# EAGLE schematic hanover-7320-20-01 (EAGLE 9.6.1), part 4 of 4
## Sheet 7 of 7: Dots R17-32 C17-32
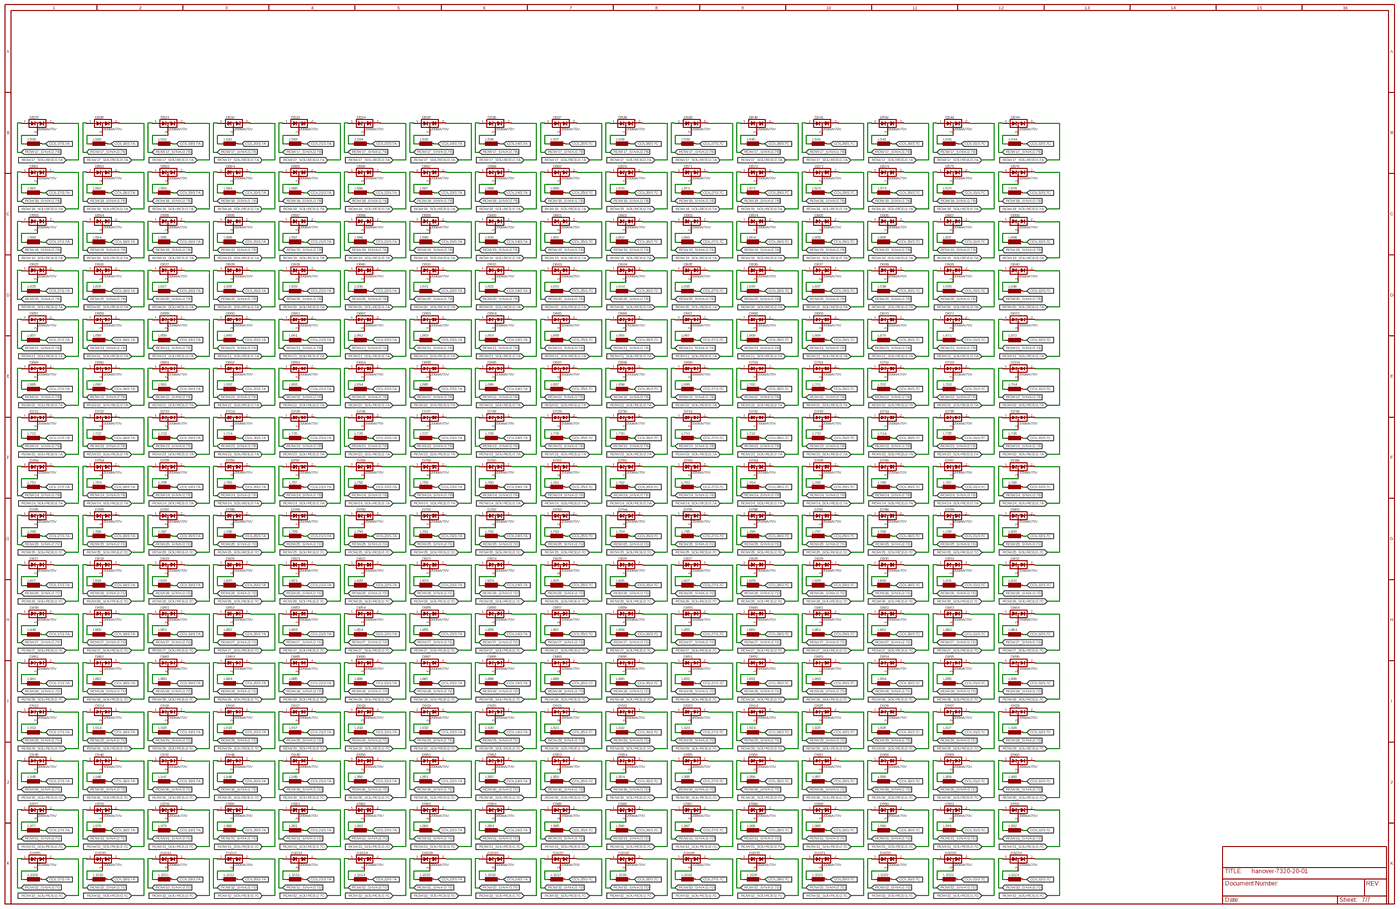
[diagram p14: schematic, sheet 7, overview]
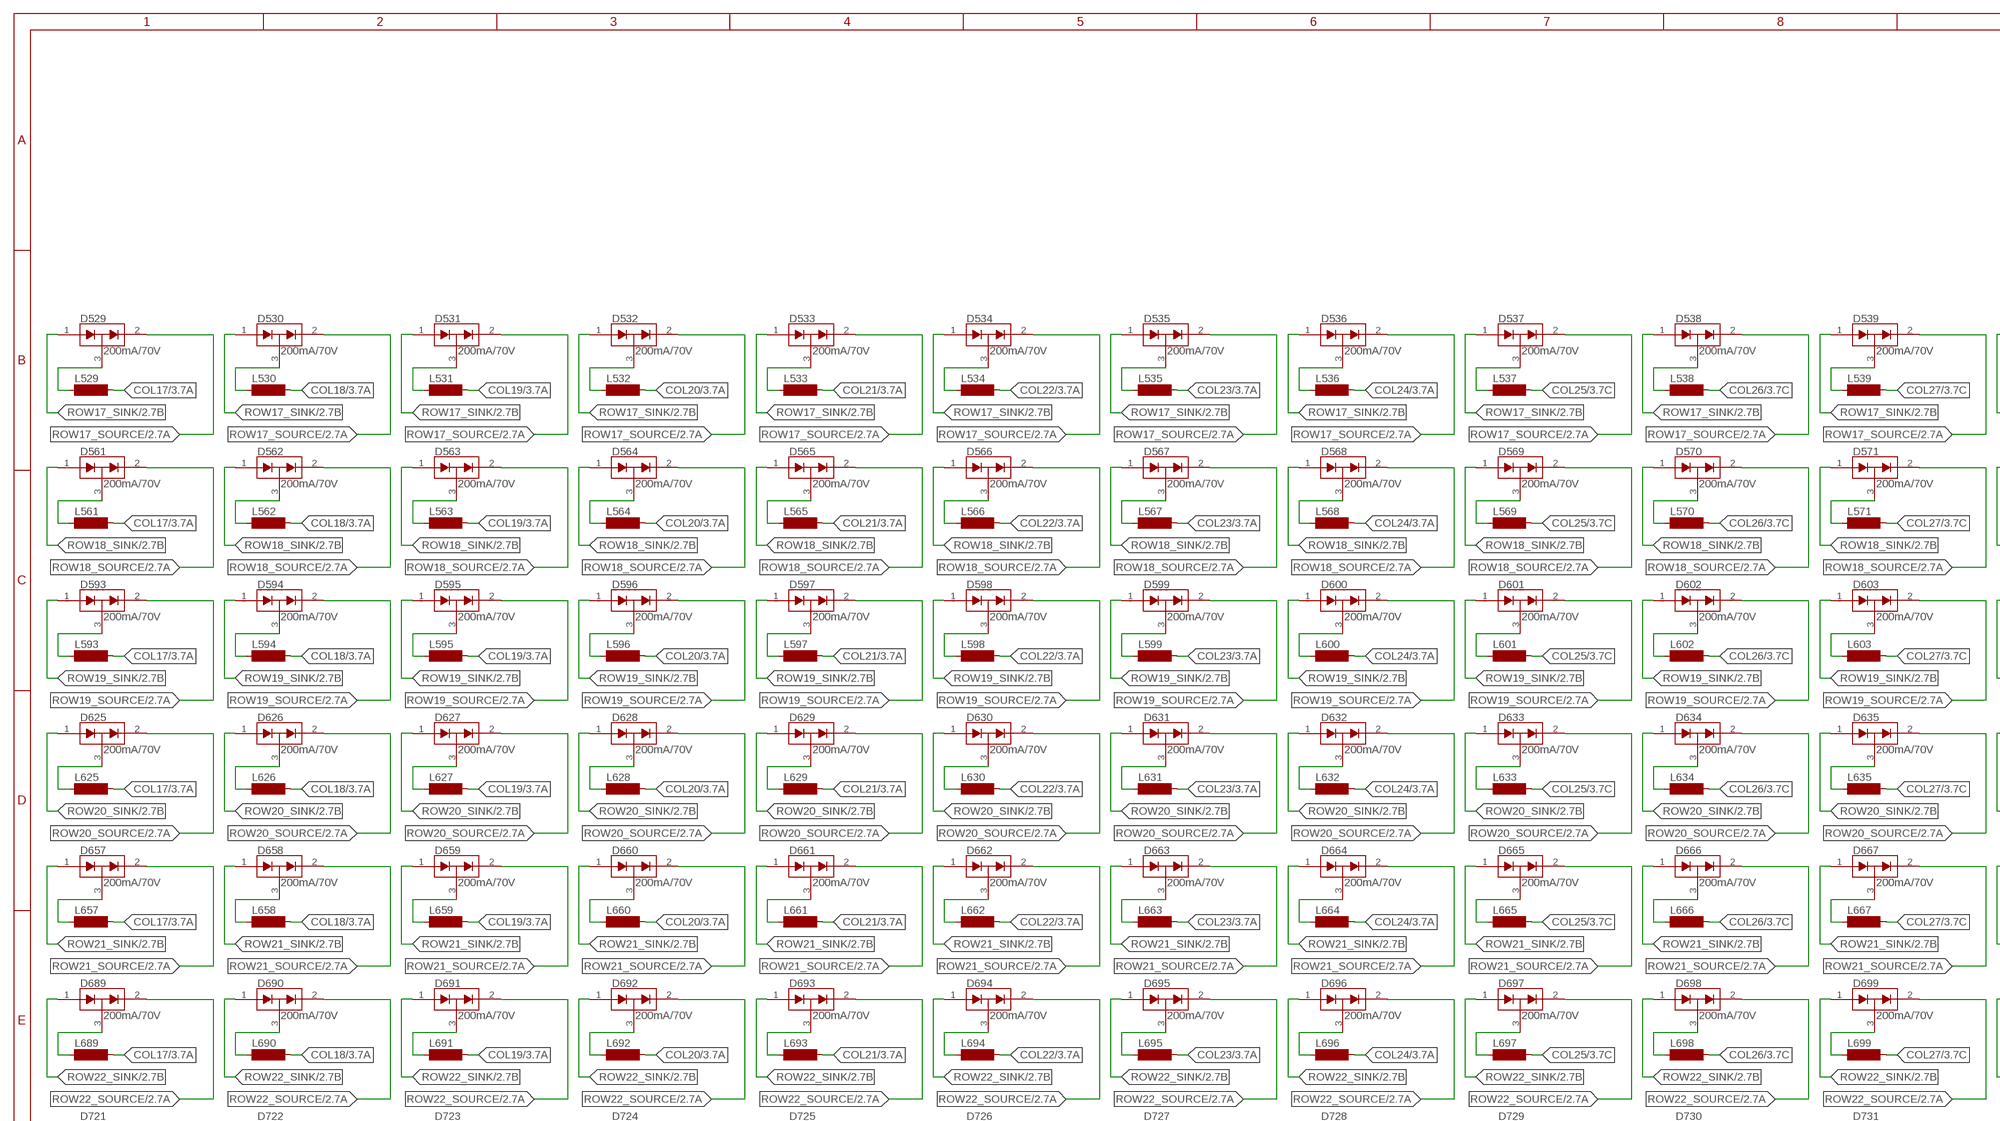
[diagram p15: schematic, sheet 7, part 1 of 4]
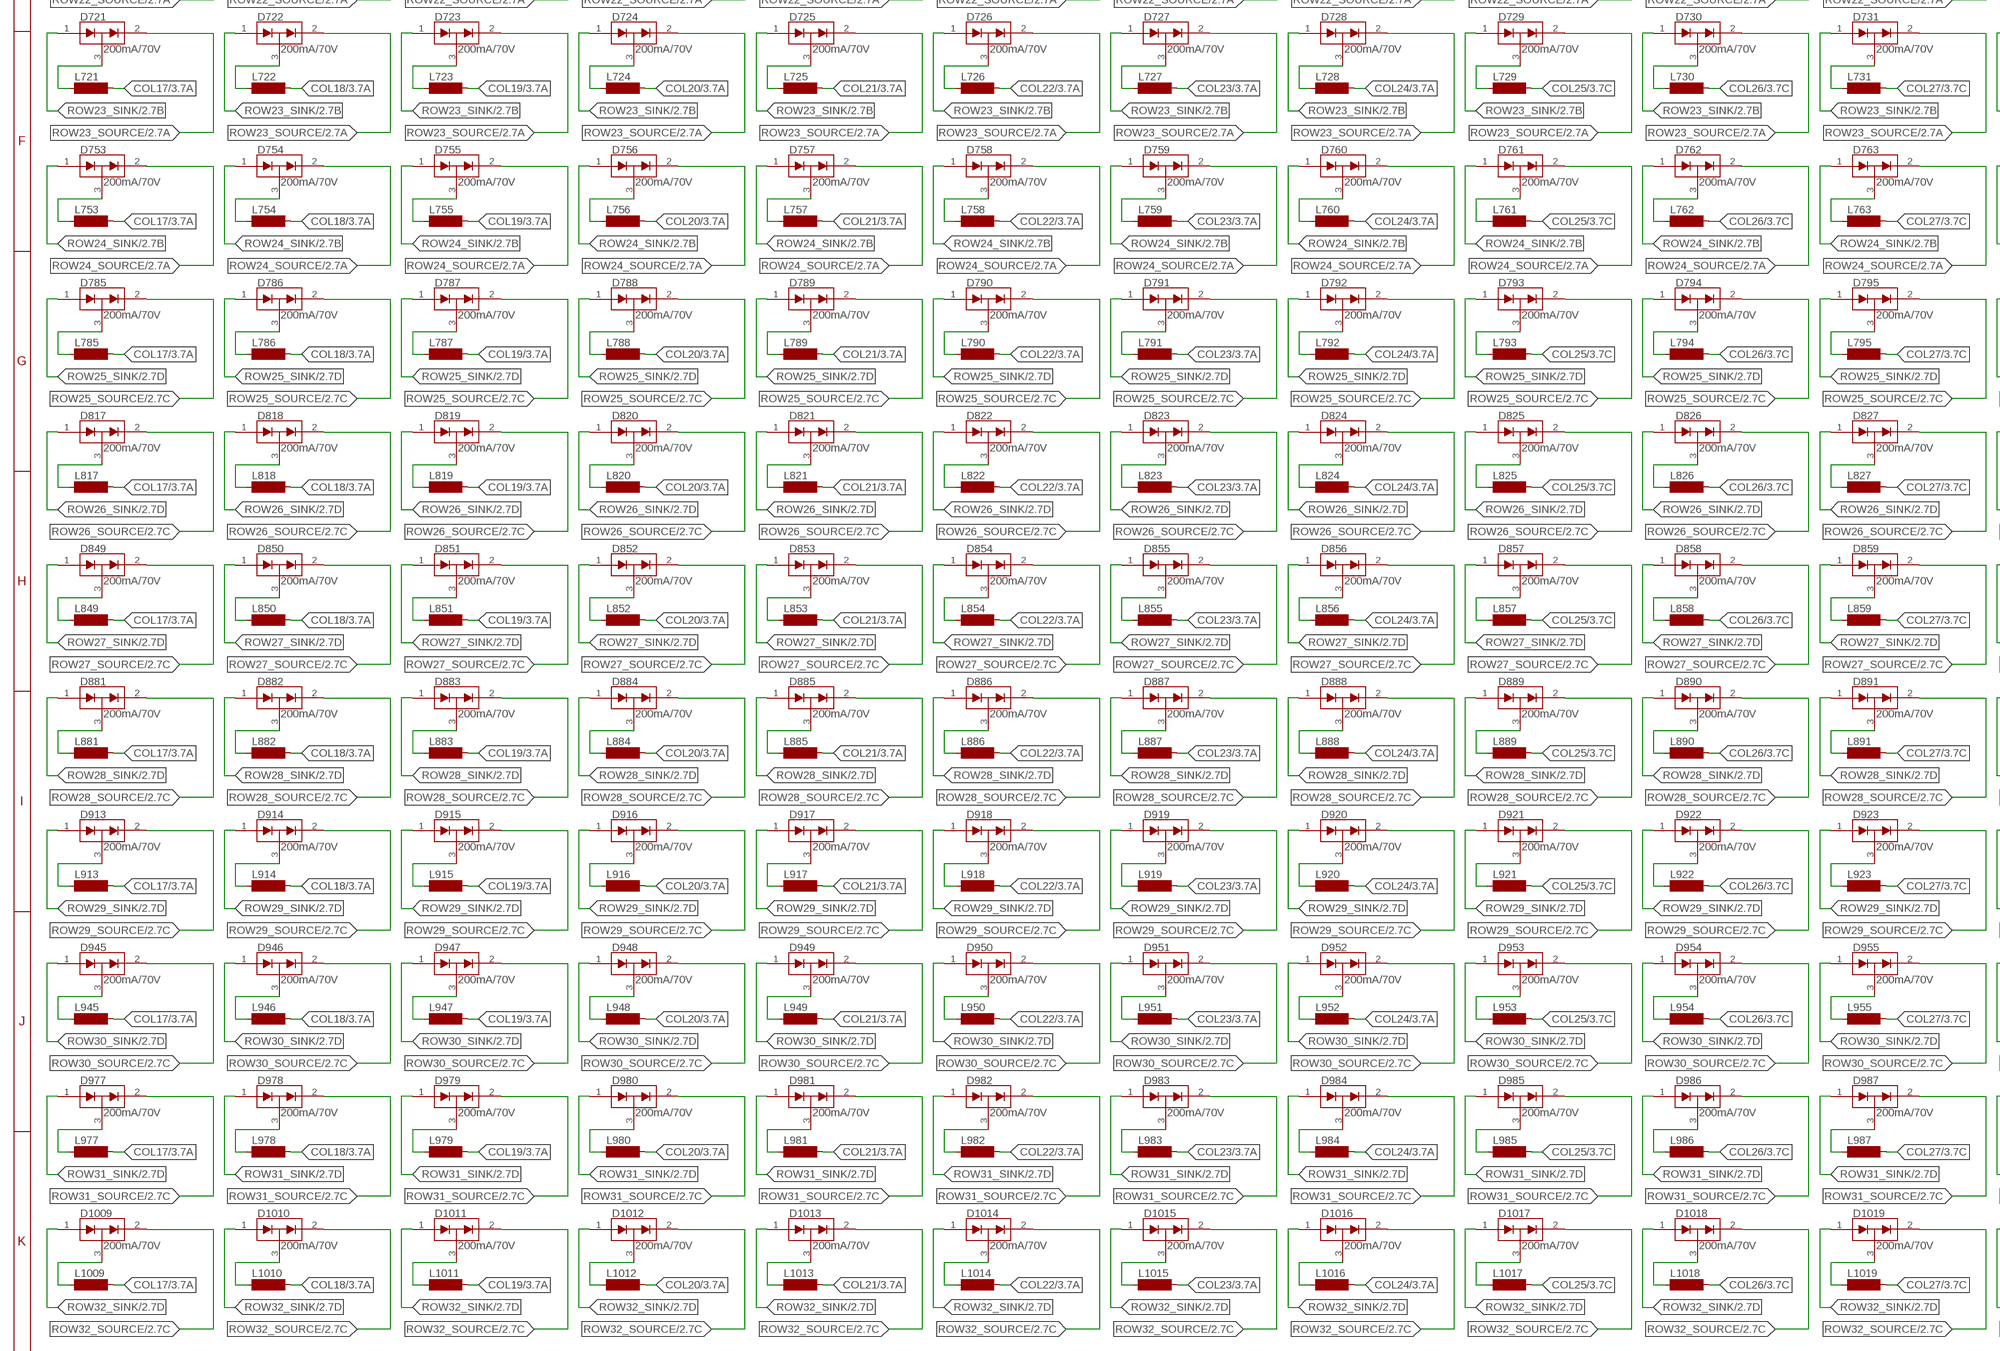
[diagram p16: schematic, sheet 7, part 2 of 4]
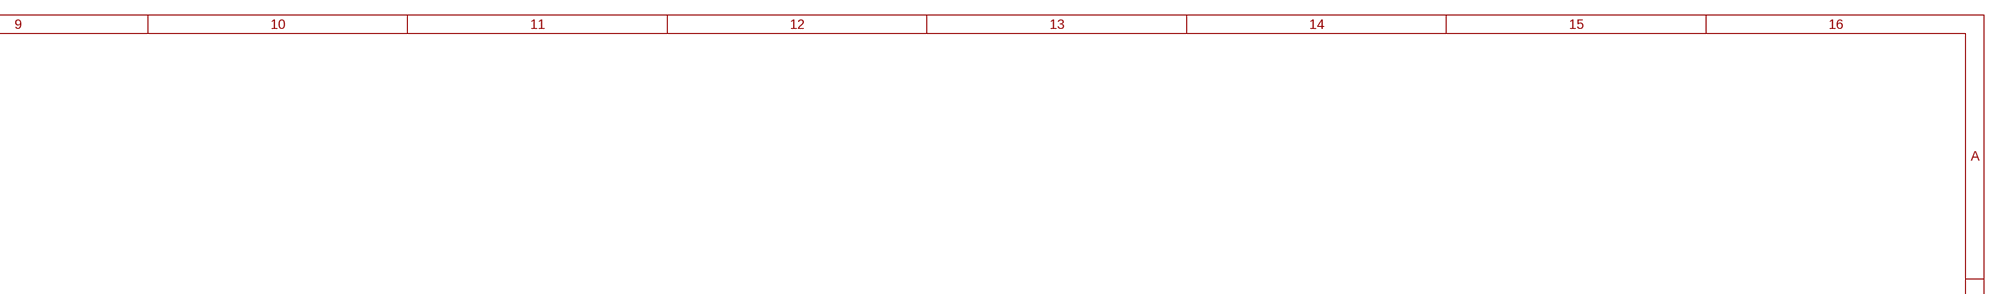
[diagram p17: schematic, sheet 7, part 3 of 4]
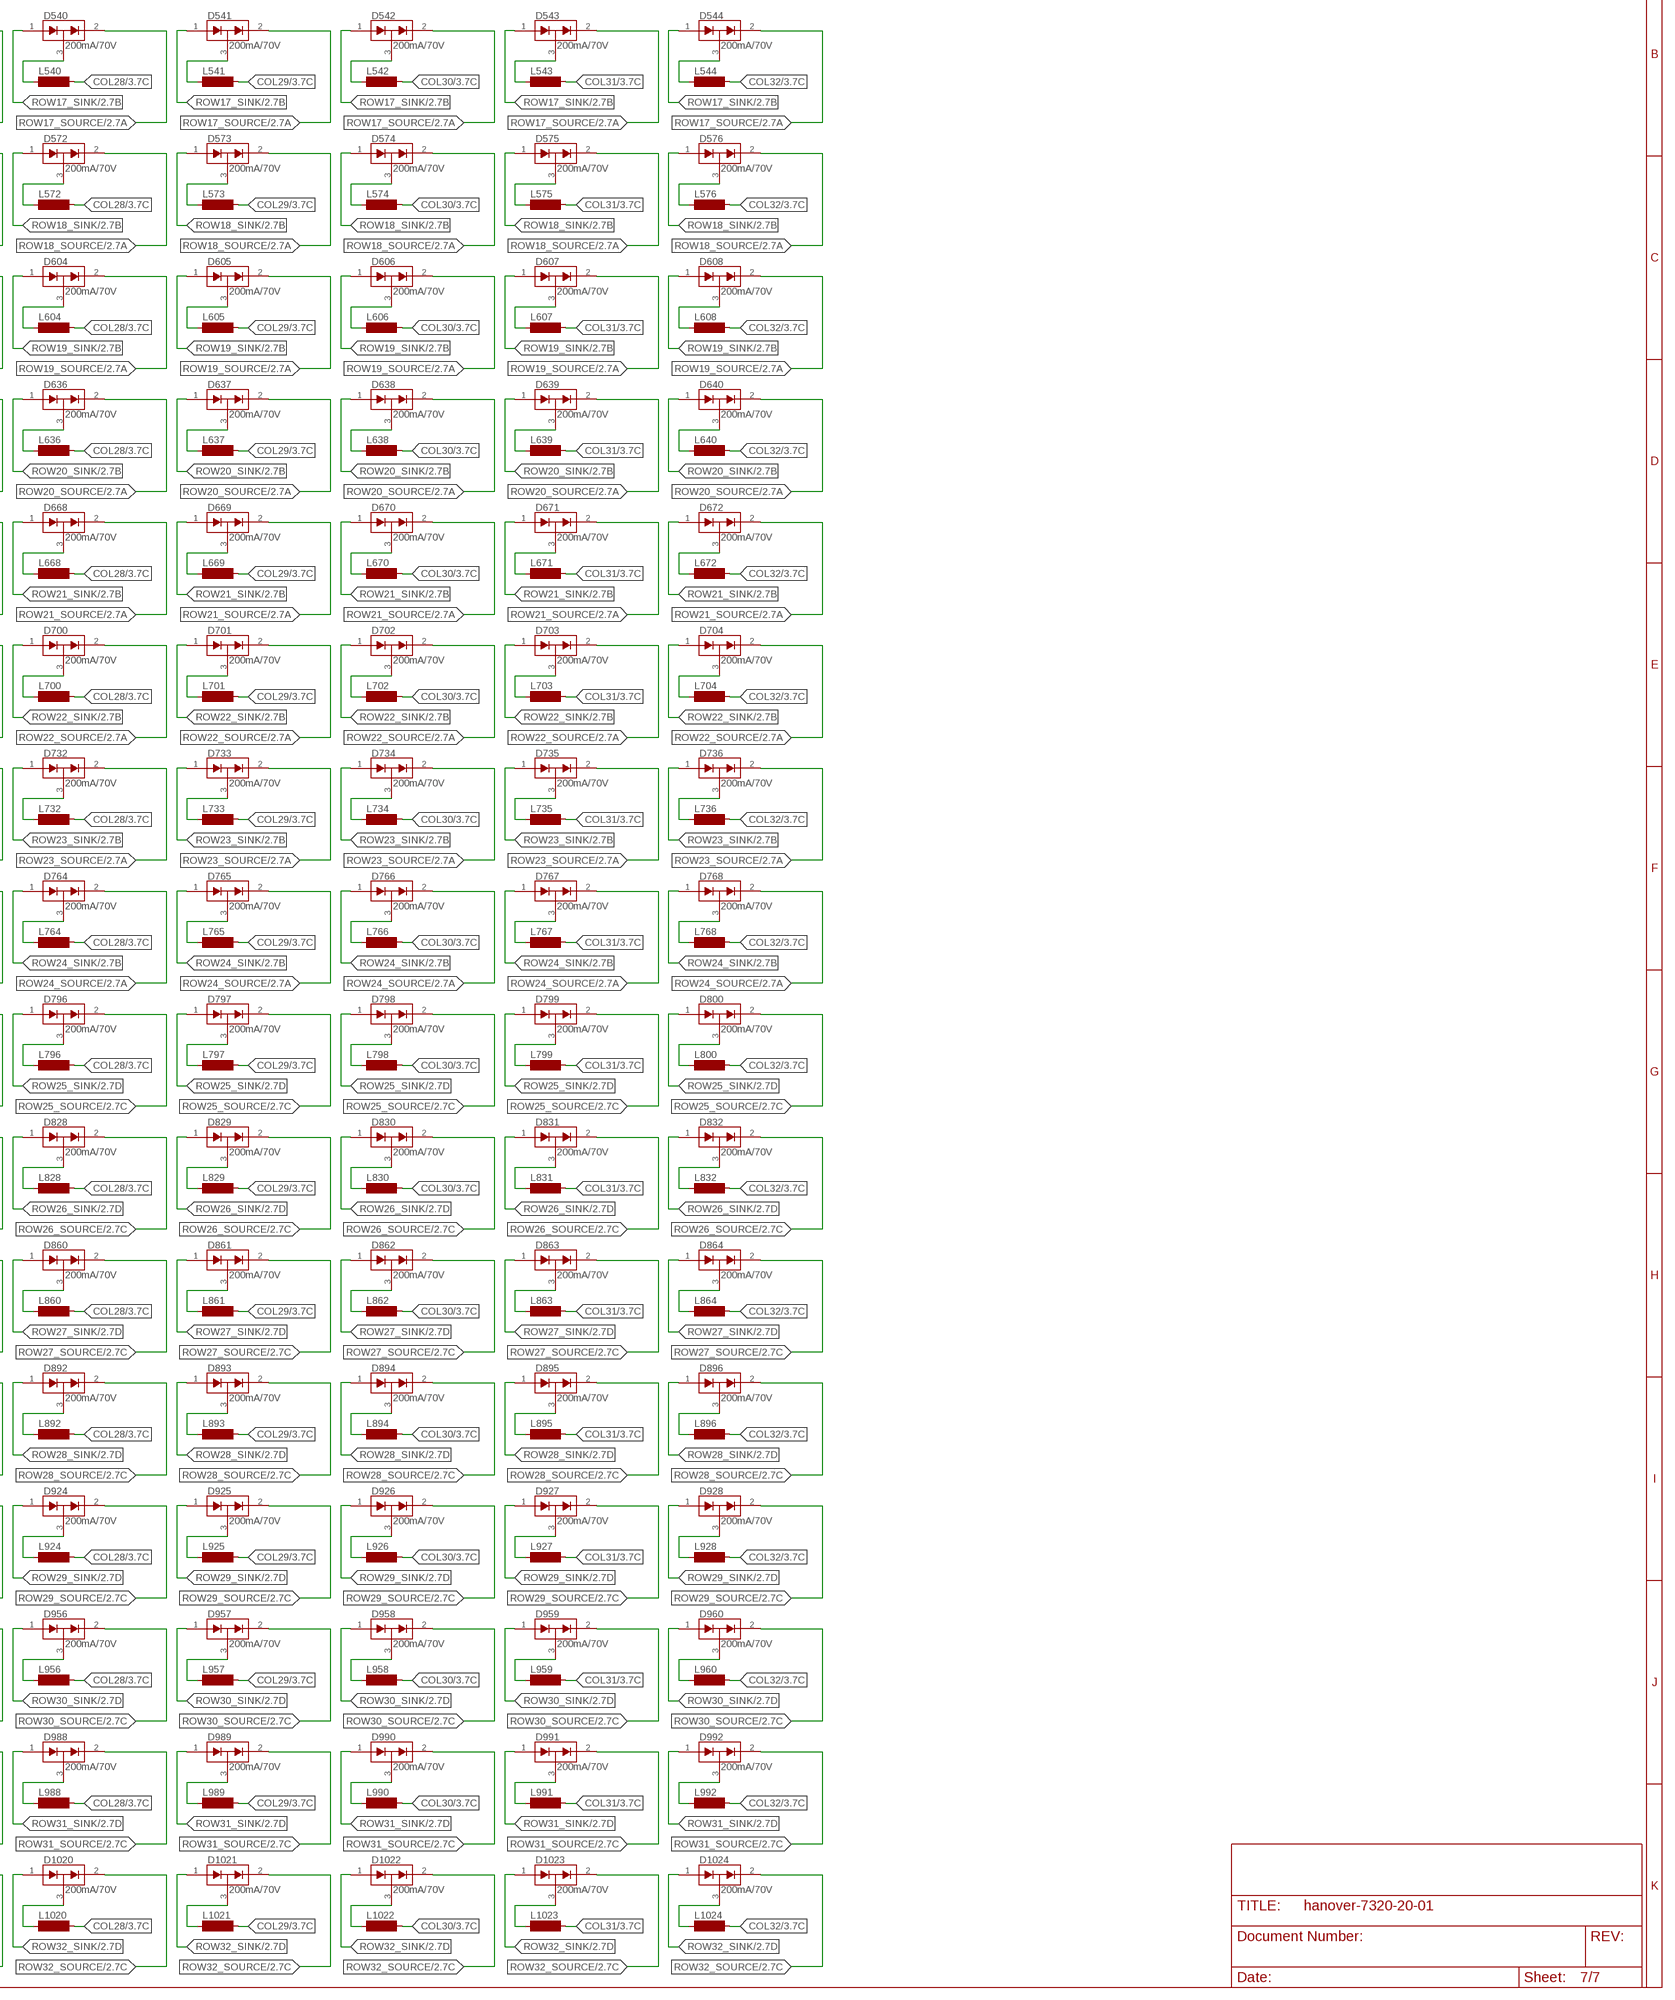
[diagram p18: schematic, sheet 7, part 4 of 4]

### Parts
D529  200mA/70V  BAV99  [SOT23-3]
D530  200mA/70V  BAV99  [SOT23-3]
D531  200mA/70V  BAV99  [SOT23-3]
D532  200mA/70V  BAV99  [SOT23-3]
D533  200mA/70V  BAV99  [SOT23-3]
D534  200mA/70V  BAV99  [SOT23-3]
D535  200mA/70V  BAV99  [SOT23-3]
D536  200mA/70V  BAV99  [SOT23-3]
D537  200mA/70V  BAV99  [SOT23-3]
D538  200mA/70V  BAV99  [SOT23-3]
D539  200mA/70V  BAV99  [SOT23-3]
D540  200mA/70V  BAV99  [SOT23-3]
D541  200mA/70V  BAV99  [SOT23-3]
D542  200mA/70V  BAV99  [SOT23-3]
D543  200mA/70V  BAV99  [SOT23-3]
D544  200mA/70V  BAV99  [SOT23-3]
D561  200mA/70V  BAV99  [SOT23-3]
D562  200mA/70V  BAV99  [SOT23-3]
D563  200mA/70V  BAV99  [SOT23-3]
D564  200mA/70V  BAV99  [SOT23-3]
D565  200mA/70V  BAV99  [SOT23-3]
D566  200mA/70V  BAV99  [SOT23-3]
D567  200mA/70V  BAV99  [SOT23-3]
D568  200mA/70V  BAV99  [SOT23-3]
D569  200mA/70V  BAV99  [SOT23-3]
D570  200mA/70V  BAV99  [SOT23-3]
D571  200mA/70V  BAV99  [SOT23-3]
D572  200mA/70V  BAV99  [SOT23-3]
D573  200mA/70V  BAV99  [SOT23-3]
D574  200mA/70V  BAV99  [SOT23-3]
D575  200mA/70V  BAV99  [SOT23-3]
D576  200mA/70V  BAV99  [SOT23-3]
D593  200mA/70V  BAV99  [SOT23-3]
D594  200mA/70V  BAV99  [SOT23-3]
D595  200mA/70V  BAV99  [SOT23-3]
D596  200mA/70V  BAV99  [SOT23-3]
D597  200mA/70V  BAV99  [SOT23-3]
D598  200mA/70V  BAV99  [SOT23-3]
D599  200mA/70V  BAV99  [SOT23-3]
D600  200mA/70V  BAV99  [SOT23-3]
D601  200mA/70V  BAV99  [SOT23-3]
D602  200mA/70V  BAV99  [SOT23-3]
D603  200mA/70V  BAV99  [SOT23-3]
D604  200mA/70V  BAV99  [SOT23-3]
D605  200mA/70V  BAV99  [SOT23-3]
D606  200mA/70V  BAV99  [SOT23-3]
D607  200mA/70V  BAV99  [SOT23-3]
D608  200mA/70V  BAV99  [SOT23-3]
D625  200mA/70V  BAV99  [SOT23-3]
D626  200mA/70V  BAV99  [SOT23-3]
D627  200mA/70V  BAV99  [SOT23-3]
D628  200mA/70V  BAV99  [SOT23-3]
D629  200mA/70V  BAV99  [SOT23-3]
D630  200mA/70V  BAV99  [SOT23-3]
D631  200mA/70V  BAV99  [SOT23-3]
D632  200mA/70V  BAV99  [SOT23-3]
D633  200mA/70V  BAV99  [SOT23-3]
D634  200mA/70V  BAV99  [SOT23-3]
D635  200mA/70V  BAV99  [SOT23-3]
D636  200mA/70V  BAV99  [SOT23-3]
D637  200mA/70V  BAV99  [SOT23-3]
D638  200mA/70V  BAV99  [SOT23-3]
D639  200mA/70V  BAV99  [SOT23-3]
D640  200mA/70V  BAV99  [SOT23-3]
D657  200mA/70V  BAV99  [SOT23-3]
D658  200mA/70V  BAV99  [SOT23-3]
D659  200mA/70V  BAV99  [SOT23-3]
D660  200mA/70V  BAV99  [SOT23-3]
D661  200mA/70V  BAV99  [SOT23-3]
D662  200mA/70V  BAV99  [SOT23-3]
D663  200mA/70V  BAV99  [SOT23-3]
D664  200mA/70V  BAV99  [SOT23-3]
D665  200mA/70V  BAV99  [SOT23-3]
D666  200mA/70V  BAV99  [SOT23-3]
D667  200mA/70V  BAV99  [SOT23-3]
D668  200mA/70V  BAV99  [SOT23-3]
D669  200mA/70V  BAV99  [SOT23-3]
D670  200mA/70V  BAV99  [SOT23-3]
D671  200mA/70V  BAV99  [SOT23-3]
D672  200mA/70V  BAV99  [SOT23-3]
D689  200mA/70V  BAV99  [SOT23-3]
D690  200mA/70V  BAV99  [SOT23-3]
D691  200mA/70V  BAV99  [SOT23-3]
D692  200mA/70V  BAV99  [SOT23-3]
D693  200mA/70V  BAV99  [SOT23-3]
D694  200mA/70V  BAV99  [SOT23-3]
D695  200mA/70V  BAV99  [SOT23-3]
D696  200mA/70V  BAV99  [SOT23-3]
D697  200mA/70V  BAV99  [SOT23-3]
D698  200mA/70V  BAV99  [SOT23-3]
D699  200mA/70V  BAV99  [SOT23-3]
D700  200mA/70V  BAV99  [SOT23-3]
D701  200mA/70V  BAV99  [SOT23-3]
D702  200mA/70V  BAV99  [SOT23-3]
D703  200mA/70V  BAV99  [SOT23-3]
D704  200mA/70V  BAV99  [SOT23-3]
D721  200mA/70V  BAV99  [SOT23-3]
D722  200mA/70V  BAV99  [SOT23-3]
D723  200mA/70V  BAV99  [SOT23-3]
D724  200mA/70V  BAV99  [SOT23-3]
D725  200mA/70V  BAV99  [SOT23-3]
D726  200mA/70V  BAV99  [SOT23-3]
D727  200mA/70V  BAV99  [SOT23-3]
D728  200mA/70V  BAV99  [SOT23-3]
D729  200mA/70V  BAV99  [SOT23-3]
D730  200mA/70V  BAV99  [SOT23-3]
D731  200mA/70V  BAV99  [SOT23-3]
D732  200mA/70V  BAV99  [SOT23-3]
D733  200mA/70V  BAV99  [SOT23-3]
D734  200mA/70V  BAV99  [SOT23-3]
D735  200mA/70V  BAV99  [SOT23-3]
D736  200mA/70V  BAV99  [SOT23-3]
D753  200mA/70V  BAV99  [SOT23-3]
D754  200mA/70V  BAV99  [SOT23-3]
D755  200mA/70V  BAV99  [SOT23-3]
D756  200mA/70V  BAV99  [SOT23-3]
D757  200mA/70V  BAV99  [SOT23-3]
D758  200mA/70V  BAV99  [SOT23-3]
D759  200mA/70V  BAV99  [SOT23-3]
D760  200mA/70V  BAV99  [SOT23-3]
D761  200mA/70V  BAV99  [SOT23-3]
D762  200mA/70V  BAV99  [SOT23-3]
D763  200mA/70V  BAV99  [SOT23-3]
D764  200mA/70V  BAV99  [SOT23-3]
D765  200mA/70V  BAV99  [SOT23-3]
D766  200mA/70V  BAV99  [SOT23-3]
D767  200mA/70V  BAV99  [SOT23-3]
D768  200mA/70V  BAV99  [SOT23-3]
D785  200mA/70V  BAV99  [SOT23-3]
D786  200mA/70V  BAV99  [SOT23-3]
D787  200mA/70V  BAV99  [SOT23-3]
D788  200mA/70V  BAV99  [SOT23-3]
D789  200mA/70V  BAV99  [SOT23-3]
D790  200mA/70V  BAV99  [SOT23-3]
D791  200mA/70V  BAV99  [SOT23-3]
D792  200mA/70V  BAV99  [SOT23-3]
D793  200mA/70V  BAV99  [SOT23-3]
D794  200mA/70V  BAV99  [SOT23-3]
D795  200mA/70V  BAV99  [SOT23-3]
D796  200mA/70V  BAV99  [SOT23-3]
D797  200mA/70V  BAV99  [SOT23-3]
D798  200mA/70V  BAV99  [SOT23-3]
D799  200mA/70V  BAV99  [SOT23-3]
D800  200mA/70V  BAV99  [SOT23-3]
D817  200mA/70V  BAV99  [SOT23-3]
D818  200mA/70V  BAV99  [SOT23-3]
D819  200mA/70V  BAV99  [SOT23-3]
D820  200mA/70V  BAV99  [SOT23-3]
D821  200mA/70V  BAV99  [SOT23-3]
D822  200mA/70V  BAV99  [SOT23-3]
D823  200mA/70V  BAV99  [SOT23-3]
D824  200mA/70V  BAV99  [SOT23-3]
D825  200mA/70V  BAV99  [SOT23-3]
D826  200mA/70V  BAV99  [SOT23-3]
D827  200mA/70V  BAV99  [SOT23-3]
D828  200mA/70V  BAV99  [SOT23-3]
D829  200mA/70V  BAV99  [SOT23-3]
D830  200mA/70V  BAV99  [SOT23-3]
D831  200mA/70V  BAV99  [SOT23-3]
D832  200mA/70V  BAV99  [SOT23-3]
D849  200mA/70V  BAV99  [SOT23-3]
D850  200mA/70V  BAV99  [SOT23-3]
D851  200mA/70V  BAV99  [SOT23-3]
D852  200mA/70V  BAV99  [SOT23-3]
D853  200mA/70V  BAV99  [SOT23-3]
D854  200mA/70V  BAV99  [SOT23-3]
D855  200mA/70V  BAV99  [SOT23-3]
D856  200mA/70V  BAV99  [SOT23-3]
D857  200mA/70V  BAV99  [SOT23-3]
D858  200mA/70V  BAV99  [SOT23-3]
D859  200mA/70V  BAV99  [SOT23-3]
D860  200mA/70V  BAV99  [SOT23-3]
D861  200mA/70V  BAV99  [SOT23-3]
D862  200mA/70V  BAV99  [SOT23-3]
D863  200mA/70V  BAV99  [SOT23-3]
D864  200mA/70V  BAV99  [SOT23-3]
D881  200mA/70V  BAV99  [SOT23-3]
D882  200mA/70V  BAV99  [SOT23-3]
D883  200mA/70V  BAV99  [SOT23-3]
D884  200mA/70V  BAV99  [SOT23-3]
D885  200mA/70V  BAV99  [SOT23-3]
D886  200mA/70V  BAV99  [SOT23-3]
D887  200mA/70V  BAV99  [SOT23-3]
D888  200mA/70V  BAV99  [SOT23-3]
D889  200mA/70V  BAV99  [SOT23-3]
D890  200mA/70V  BAV99  [SOT23-3]
D891  200mA/70V  BAV99  [SOT23-3]
D892  200mA/70V  BAV99  [SOT23-3]
D893  200mA/70V  BAV99  [SOT23-3]
D894  200mA/70V  BAV99  [SOT23-3]
D895  200mA/70V  BAV99  [SOT23-3]
D896  200mA/70V  BAV99  [SOT23-3]
D913  200mA/70V  BAV99  [SOT23-3]
D914  200mA/70V  BAV99  [SOT23-3]
D915  200mA/70V  BAV99  [SOT23-3]
D916  200mA/70V  BAV99  [SOT23-3]
D917  200mA/70V  BAV99  [SOT23-3]
D918  200mA/70V  BAV99  [SOT23-3]
D919  200mA/70V  BAV99  [SOT23-3]
D920  200mA/70V  BAV99  [SOT23-3]
D921  200mA/70V  BAV99  [SOT23-3]
D922  200mA/70V  BAV99  [SOT23-3]
D923  200mA/70V  BAV99  [SOT23-3]
D924  200mA/70V  BAV99  [SOT23-3]
D925  200mA/70V  BAV99  [SOT23-3]
D926  200mA/70V  BAV99  [SOT23-3]
D927  200mA/70V  BAV99  [SOT23-3]
D928  200mA/70V  BAV99  [SOT23-3]
D945  200mA/70V  BAV99  [SOT23-3]
D946  200mA/70V  BAV99  [SOT23-3]
D947  200mA/70V  BAV99  [SOT23-3]
D948  200mA/70V  BAV99  [SOT23-3]
D949  200mA/70V  BAV99  [SOT23-3]
D950  200mA/70V  BAV99  [SOT23-3]
D951  200mA/70V  BAV99  [SOT23-3]
D952  200mA/70V  BAV99  [SOT23-3]
D953  200mA/70V  BAV99  [SOT23-3]
D954  200mA/70V  BAV99  [SOT23-3]
D955  200mA/70V  BAV99  [SOT23-3]
D956  200mA/70V  BAV99  [SOT23-3]
D957  200mA/70V  BAV99  [SOT23-3]
D958  200mA/70V  BAV99  [SOT23-3]
D959  200mA/70V  BAV99  [SOT23-3]
D960  200mA/70V  BAV99  [SOT23-3]
D977  200mA/70V  BAV99  [SOT23-3]
D978  200mA/70V  BAV99  [SOT23-3]
D979  200mA/70V  BAV99  [SOT23-3]
D980  200mA/70V  BAV99  [SOT23-3]
D981  200mA/70V  BAV99  [SOT23-3]
D982  200mA/70V  BAV99  [SOT23-3]
D983  200mA/70V  BAV99  [SOT23-3]
D984  200mA/70V  BAV99  [SOT23-3]
D985  200mA/70V  BAV99  [SOT23-3]
D986  200mA/70V  BAV99  [SOT23-3]
D987  200mA/70V  BAV99  [SOT23-3]
D988  200mA/70V  BAV99  [SOT23-3]
D989  200mA/70V  BAV99  [SOT23-3]
D990  200mA/70V  BAV99  [SOT23-3]
D991  200mA/70V  BAV99  [SOT23-3]
D992  200mA/70V  BAV99  [SOT23-3]
D1009  200mA/70V  BAV99  [SOT23-3]
D1010  200mA/70V  BAV99  [SOT23-3]
D1011  200mA/70V  BAV99  [SOT23-3]
D1012  200mA/70V  BAV99  [SOT23-3]
D1013  200mA/70V  BAV99  [SOT23-3]
D1014  200mA/70V  BAV99  [SOT23-3]
D1015  200mA/70V  BAV99  [SOT23-3]
D1016  200mA/70V  BAV99  [SOT23-3]
D1017  200mA/70V  BAV99  [SOT23-3]
D1018  200mA/70V  BAV99  [SOT23-3]
D1019  200mA/70V  BAV99  [SOT23-3]
D1020  200mA/70V  BAV99  [SOT23-3]
D1021  200mA/70V  BAV99  [SOT23-3]
D1022  200mA/70V  BAV99  [SOT23-3]
D1023  200mA/70V  BAV99  [SOT23-3]
D1024  200mA/70V  BAV99  [SOT23-3]
L529  SD8  [SD8]
L530  SD8  [SD8]
L531  SD8  [SD8]
L532  SD8  [SD8]
L533  SD8  [SD8]
L534  SD8  [SD8]
L535  SD8  [SD8]
L536  SD8  [SD8]
L537  SD8  [SD8]
L538  SD8  [SD8]
L539  SD8  [SD8]
L540  SD8  [SD8]
L541  SD8  [SD8]
L542  SD8  [SD8]
L543  SD8  [SD8]
L544  SD8  [SD8]
L561  SD8  [SD8]
L562  SD8  [SD8]
L563  SD8  [SD8]
L564  SD8  [SD8]
L565  SD8  [SD8]
L566  SD8  [SD8]
L567  SD8  [SD8]
L568  SD8  [SD8]
L569  SD8  [SD8]
L570  SD8  [SD8]
L571  SD8  [SD8]
L572  SD8  [SD8]
L573  SD8  [SD8]
L574  SD8  [SD8]
L575  SD8  [SD8]
L576  SD8  [SD8]
L593  SD8  [SD8]
L594  SD8  [SD8]
L595  SD8  [SD8]
L596  SD8  [SD8]
L597  SD8  [SD8]
L598  SD8  [SD8]
L599  SD8  [SD8]
L600  SD8  [SD8]
L601  SD8  [SD8]
L602  SD8  [SD8]
L603  SD8  [SD8]
L604  SD8  [SD8]
L605  SD8  [SD8]
L606  SD8  [SD8]
L607  SD8  [SD8]
L608  SD8  [SD8]
L625  SD8  [SD8]
L626  SD8  [SD8]
L627  SD8  [SD8]
L628  SD8  [SD8]
L629  SD8  [SD8]
L630  SD8  [SD8]
L631  SD8  [SD8]
L632  SD8  [SD8]
L633  SD8  [SD8]
L634  SD8  [SD8]
L635  SD8  [SD8]
L636  SD8  [SD8]
L637  SD8  [SD8]
L638  SD8  [SD8]
L639  SD8  [SD8]
L640  SD8  [SD8]
L657  SD8  [SD8]
L658  SD8  [SD8]
L659  SD8  [SD8]
L660  SD8  [SD8]
L661  SD8  [SD8]
L662  SD8  [SD8]
L663  SD8  [SD8]
L664  SD8  [SD8]
L665  SD8  [SD8]
L666  SD8  [SD8]
L667  SD8  [SD8]
L668  SD8  [SD8]
L669  SD8  [SD8]
L670  SD8  [SD8]
L671  SD8  [SD8]
L672  SD8  [SD8]
L689  SD8  [SD8]
L690  SD8  [SD8]
L691  SD8  [SD8]
L692  SD8  [SD8]
L693  SD8  [SD8]
L694  SD8  [SD8]
L695  SD8  [SD8]
L696  SD8  [SD8]
L697  SD8  [SD8]
L698  SD8  [SD8]
L699  SD8  [SD8]
L700  SD8  [SD8]
L701  SD8  [SD8]
L702  SD8  [SD8]
L703  SD8  [SD8]
L704  SD8  [SD8]
L721  SD8  [SD8]
L722  SD8  [SD8]
L723  SD8  [SD8]
L724  SD8  [SD8]
L725  SD8  [SD8]
L726  SD8  [SD8]
L727  SD8  [SD8]
L728  SD8  [SD8]
L729  SD8  [SD8]
L730  SD8  [SD8]
L731  SD8  [SD8]
L732  SD8  [SD8]
L733  SD8  [SD8]
L734  SD8  [SD8]
L735  SD8  [SD8]
L736  SD8  [SD8]
L753  SD8  [SD8]
L754  SD8  [SD8]
L755  SD8  [SD8]
L756  SD8  [SD8]
L757  SD8  [SD8]
L758  SD8  [SD8]
L759  SD8  [SD8]
L760  SD8  [SD8]
L761  SD8  [SD8]
L762  SD8  [SD8]
L763  SD8  [SD8]
L764  SD8  [SD8]
L765  SD8  [SD8]
L766  SD8  [SD8]
L767  SD8  [SD8]
L768  SD8  [SD8]
L785  SD8  [SD8]
L786  SD8  [SD8]
L787  SD8  [SD8]
L788  SD8  [SD8]
L789  SD8  [SD8]
L790  SD8  [SD8]
L791  SD8  [SD8]
L792  SD8  [SD8]
L793  SD8  [SD8]
L794  SD8  [SD8]
L795  SD8  [SD8]
L796  SD8  [SD8]
L797  SD8  [SD8]
L798  SD8  [SD8]
L799  SD8  [SD8]
L800  SD8  [SD8]
L817  SD8  [SD8]
L818  SD8  [SD8]
L819  SD8  [SD8]
L820  SD8  [SD8]
L821  SD8  [SD8]
L822  SD8  [SD8]
L823  SD8  [SD8]
L824  SD8  [SD8]
L825  SD8  [SD8]
L826  SD8  [SD8]
L827  SD8  [SD8]
L828  SD8  [SD8]
L829  SD8  [SD8]
L830  SD8  [SD8]
L831  SD8  [SD8]
L832  SD8  [SD8]
L849  SD8  [SD8]
L850  SD8  [SD8]
L851  SD8  [SD8]
L852  SD8  [SD8]
L853  SD8  [SD8]
L854  SD8  [SD8]
L855  SD8  [SD8]
L856  SD8  [SD8]
L857  SD8  [SD8]
L858  SD8  [SD8]
L859  SD8  [SD8]
L860  SD8  [SD8]
L861  SD8  [SD8]
L862  SD8  [SD8]
L863  SD8  [SD8]
L864  SD8  [SD8]
L881  SD8  [SD8]
L882  SD8  [SD8]
L883  SD8  [SD8]
L884  SD8  [SD8]
L885  SD8  [SD8]
L886  SD8  [SD8]
L887  SD8  [SD8]
L888  SD8  [SD8]
L889  SD8  [SD8]
L890  SD8  [SD8]
L891  SD8  [SD8]
L892  SD8  [SD8]
L893  SD8  [SD8]
L894  SD8  [SD8]
L895  SD8  [SD8]
L896  SD8  [SD8]
L913  SD8  [SD8]
L914  SD8  [SD8]
L915  SD8  [SD8]
L916  SD8  [SD8]
L917  SD8  [SD8]
L918  SD8  [SD8]
L919  SD8  [SD8]
L920  SD8  [SD8]
L921  SD8  [SD8]
L922  SD8  [SD8]
L923  SD8  [SD8]
L924  SD8  [SD8]
L925  SD8  [SD8]
L926  SD8  [SD8]
L927  SD8  [SD8]
L928  SD8  [SD8]
L945  SD8  [SD8]
L946  SD8  [SD8]
L947  SD8  [SD8]
L948  SD8  [SD8]
L949  SD8  [SD8]
L950  SD8  [SD8]
L951  SD8  [SD8]
L952  SD8  [SD8]
L953  SD8  [SD8]
L954  SD8  [SD8]
L955  SD8  [SD8]
L956  SD8  [SD8]
L957  SD8  [SD8]
L958  SD8  [SD8]
L959  SD8  [SD8]
L960  SD8  [SD8]
L977  SD8  [SD8]
L978  SD8  [SD8]
L979  SD8  [SD8]
L980  SD8  [SD8]
L981  SD8  [SD8]
L982  SD8  [SD8]
L983  SD8  [SD8]
L984  SD8  [SD8]
L985  SD8  [SD8]
L986  SD8  [SD8]
L987  SD8  [SD8]
L988  SD8  [SD8]
L989  SD8  [SD8]
L990  SD8  [SD8]
L991  SD8  [SD8]
L992  SD8  [SD8]
L1009  SD8  [SD8]
L1010  SD8  [SD8]
L1011  SD8  [SD8]
L1012  SD8  [SD8]
L1013  SD8  [SD8]
L1014  SD8  [SD8]
L1015  SD8  [SD8]
L1016  SD8  [SD8]
L1017  SD8  [SD8]
L1018  SD8  [SD8]
L1019  SD8  [SD8]
L1020  SD8  [SD8]
L1021  SD8  [SD8]
L1022  SD8  [SD8]
L1023  SD8  [SD8]
L1024  SD8  [SD8]

### Nets
COL17: L529.2 L561.2 L593.2 L625.2 L657.2 L689.2 L721.2 L753.2 L785.2 L817.2 L849.2 L881.2 L913.2 L945.2 L977.2 L1009.2 ; also sheet 3,5
COL18: L530.2 L562.2 L594.2 L626.2 L658.2 L690.2 L722.2 L754.2 L786.2 L818.2 L850.2 L882.2 L914.2 L946.2 L978.2 L1010.2 ; also sheet 3,5
COL19: L531.2 L563.2 L595.2 L627.2 L659.2 L691.2 L723.2 L755.2 L787.2 L819.2 L851.2 L883.2 L915.2 L947.2 L979.2 L1011.2 ; also sheet 3,5
COL20: L532.2 L564.2 L596.2 L628.2 L660.2 L692.2 L724.2 L756.2 L788.2 L820.2 L852.2 L884.2 L916.2 L948.2 L980.2 L1012.2 ; also sheet 3,5
COL21: L533.2 L565.2 L597.2 L629.2 L661.2 L693.2 L725.2 L757.2 L789.2 L821.2 L853.2 L885.2 L917.2 L949.2 L981.2 L1013.2 ; also sheet 3,5
COL22: L534.2 L566.2 L598.2 L630.2 L662.2 L694.2 L726.2 L758.2 L790.2 L822.2 L854.2 L886.2 L918.2 L950.2 L982.2 L1014.2 ; also sheet 3,5
COL23: L535.2 L567.2 L599.2 L631.2 L663.2 L695.2 L727.2 L759.2 L791.2 L823.2 L855.2 L887.2 L919.2 L951.2 L983.2 L1015.2 ; also sheet 3,5
COL24: L536.2 L568.2 L600.2 L632.2 L664.2 L696.2 L728.2 L760.2 L792.2 L824.2 L856.2 L888.2 L920.2 L952.2 L984.2 L1016.2 ; also sheet 3,5
COL25: L537.2 L569.2 L601.2 L633.2 L665.2 L697.2 L729.2 L761.2 L793.2 L825.2 L857.2 L889.2 L921.2 L953.2 L985.2 L1017.2 ; also sheet 3,5
COL26: L538.2 L570.2 L602.2 L634.2 L666.2 L698.2 L730.2 L762.2 L794.2 L826.2 L858.2 L890.2 L922.2 L954.2 L986.2 L1018.2 ; also sheet 3,5
COL27: L539.2 L571.2 L603.2 L635.2 L667.2 L699.2 L731.2 L763.2 L795.2 L827.2 L859.2 L891.2 L923.2 L955.2 L987.2 L1019.2 ; also sheet 3,5
COL28: L540.2 L572.2 L604.2 L636.2 L668.2 L700.2 L732.2 L764.2 L796.2 L828.2 L860.2 L892.2 L924.2 L956.2 L988.2 L1020.2 ; also sheet 3,5
COL29: L541.2 L573.2 L605.2 L637.2 L669.2 L701.2 L733.2 L765.2 L797.2 L829.2 L861.2 L893.2 L925.2 L957.2 L989.2 L1021.2 ; also sheet 3,5
COL30: L542.2 L574.2 L606.2 L638.2 L670.2 L702.2 L734.2 L766.2 L798.2 L830.2 L862.2 L894.2 L926.2 L958.2 L990.2 L1022.2 ; also sheet 3,5
COL31: L543.2 L575.2 L607.2 L639.2 L671.2 L703.2 L735.2 L767.2 L799.2 L831.2 L863.2 L895.2 L927.2 L959.2 L991.2 L1023.2 ; also sheet 3,5
COL32: L544.2 L576.2 L608.2 L640.2 L672.2 L704.2 L736.2 L768.2 L800.2 L832.2 L864.2 L896.2 L928.2 L960.2 L992.2 L1024.2 ; also sheet 3,5
N$543: D529.3(COM) L529.1
N$544: D530.3(COM) L530.1
N$545: D531.3(COM) L531.1
N$546: D532.3(COM) L532.1
N$547: D533.3(COM) L533.1
N$548: D534.3(COM) L534.1
N$549: D535.3(COM) L535.1
N$550: D536.3(COM) L536.1
N$551: D537.3(COM) L537.1
N$552: D538.3(COM) L538.1
N$553: D539.3(COM) L539.1
N$554: D540.3(COM) L540.1
N$555: D541.3(COM) L541.1
N$556: D542.3(COM) L542.1
N$557: D543.3(COM) L543.1
N$558: D544.3(COM) L544.1
N$575: D561.3(COM) L561.1
N$576: D562.3(COM) L562.1
N$577: D563.3(COM) L563.1
N$578: D564.3(COM) L564.1
N$579: D565.3(COM) L565.1
N$580: D566.3(COM) L566.1
N$581: D567.3(COM) L567.1
N$582: D568.3(COM) L568.1
N$583: D569.3(COM) L569.1
N$584: D570.3(COM) L570.1
N$585: D571.3(COM) L571.1
N$586: D572.3(COM) L572.1
N$587: D573.3(COM) L573.1
N$588: D574.3(COM) L574.1
N$589: D575.3(COM) L575.1
N$590: D576.3(COM) L576.1
N$607: D593.3(COM) L593.1
N$608: D594.3(COM) L594.1
N$609: D595.3(COM) L595.1
N$610: D596.3(COM) L596.1
N$611: D597.3(COM) L597.1
N$612: D598.3(COM) L598.1
N$613: D599.3(COM) L599.1
N$614: D600.3(COM) L600.1
N$615: D601.3(COM) L601.1
N$616: D602.3(COM) L602.1
N$617: D603.3(COM) L603.1
N$618: D604.3(COM) L604.1
N$619: D605.3(COM) L605.1
N$620: D606.3(COM) L606.1
N$621: D607.3(COM) L607.1
N$622: D608.3(COM) L608.1
N$639: D625.3(COM) L625.1
N$640: D626.3(COM) L626.1
N$641: D627.3(COM) L627.1
N$642: D628.3(COM) L628.1
N$643: D629.3(COM) L629.1
N$644: D630.3(COM) L630.1
N$645: D631.3(COM) L631.1
N$646: D632.3(COM) L632.1
N$647: D633.3(COM) L633.1
N$648: D634.3(COM) L634.1
N$649: D635.3(COM) L635.1
N$650: D636.3(COM) L636.1
N$651: D637.3(COM) L637.1
N$652: D638.3(COM) L638.1
N$653: D639.3(COM) L639.1
N$654: D640.3(COM) L640.1
N$671: D657.3(COM) L657.1
N$672: D658.3(COM) L658.1
N$673: D659.3(COM) L659.1
N$674: D660.3(COM) L660.1
N$675: D661.3(COM) L661.1
N$676: D662.3(COM) L662.1
N$677: D663.3(COM) L663.1
N$678: D664.3(COM) L664.1
N$679: D665.3(COM) L665.1
N$680: D666.3(COM) L666.1
N$681: D667.3(COM) L667.1
N$682: D668.3(COM) L668.1
N$683: D669.3(COM) L669.1
N$684: D670.3(COM) L670.1
N$685: D671.3(COM) L671.1
N$686: D672.3(COM) L672.1
N$703: D689.3(COM) L689.1
N$704: D690.3(COM) L690.1
N$705: D691.3(COM) L691.1
N$706: D692.3(COM) L692.1
N$707: D693.3(COM) L693.1
N$708: D694.3(COM) L694.1
N$709: D695.3(COM) L695.1
N$710: D696.3(COM) L696.1
N$711: D697.3(COM) L697.1
N$712: D698.3(COM) L698.1
N$713: D699.3(COM) L699.1
N$714: D700.3(COM) L700.1
N$715: D701.3(COM) L701.1
N$716: D702.3(COM) L702.1
N$717: D703.3(COM) L703.1
N$718: D704.3(COM) L704.1
N$735: D721.3(COM) L721.1
N$736: D722.3(COM) L722.1
N$737: D723.3(COM) L723.1
N$738: D724.3(COM) L724.1
N$739: D725.3(COM) L725.1
N$740: D726.3(COM) L726.1
N$741: D727.3(COM) L727.1
N$742: D728.3(COM) L728.1
N$743: D729.3(COM) L729.1
N$744: D730.3(COM) L730.1
N$745: D731.3(COM) L731.1
N$746: D732.3(COM) L732.1
N$747: D733.3(COM) L733.1
N$748: D734.3(COM) L734.1
N$749: D735.3(COM) L735.1
N$750: D736.3(COM) L736.1
N$767: D753.3(COM) L753.1
N$768: D754.3(COM) L754.1
N$769: D755.3(COM) L755.1
N$770: D756.3(COM) L756.1
N$771: D757.3(COM) L757.1
N$772: D758.3(COM) L758.1
N$773: D759.3(COM) L759.1
N$774: D760.3(COM) L760.1
N$775: D761.3(COM) L761.1
N$776: D762.3(COM) L762.1
N$777: D763.3(COM) L763.1
N$778: D764.3(COM) L764.1
N$779: D765.3(COM) L765.1
N$780: D766.3(COM) L766.1
N$781: D767.3(COM) L767.1
N$782: D768.3(COM) L768.1
N$799: D785.3(COM) L785.1
N$800: D786.3(COM) L786.1
N$801: D787.3(COM) L787.1
N$802: D788.3(COM) L788.1
N$803: D789.3(COM) L789.1
N$804: D790.3(COM) L790.1
N$805: D791.3(COM) L791.1
N$806: D792.3(COM) L792.1
N$807: D793.3(COM) L793.1
N$808: D794.3(COM) L794.1
N$809: D795.3(COM) L795.1
N$810: D796.3(COM) L796.1
N$811: D797.3(COM) L797.1
N$812: D798.3(COM) L798.1
N$813: D799.3(COM) L799.1
N$814: D800.3(COM) L800.1
N$831: D817.3(COM) L817.1
N$832: D818.3(COM) L818.1
N$833: D819.3(COM) L819.1
N$834: D820.3(COM) L820.1
N$835: D821.3(COM) L821.1
N$836: D822.3(COM) L822.1
N$837: D823.3(COM) L823.1
N$838: D824.3(COM) L824.1
N$839: D825.3(COM) L825.1
N$840: D826.3(COM) L826.1
N$841: D827.3(COM) L827.1
N$842: D828.3(COM) L828.1
N$843: D829.3(COM) L829.1
N$844: D830.3(COM) L830.1
N$845: D831.3(COM) L831.1
N$846: D832.3(COM) L832.1
N$863: D849.3(COM) L849.1
N$864: D850.3(COM) L850.1
N$865: D851.3(COM) L851.1
N$866: D852.3(COM) L852.1
N$867: D853.3(COM) L853.1
N$868: D854.3(COM) L854.1
N$869: D855.3(COM) L855.1
N$870: D856.3(COM) L856.1
N$871: D857.3(COM) L857.1
N$872: D858.3(COM) L858.1
N$873: D859.3(COM) L859.1
N$874: D860.3(COM) L860.1
N$875: D861.3(COM) L861.1
N$876: D862.3(COM) L862.1
N$877: D863.3(COM) L863.1
N$878: D864.3(COM) L864.1
N$895: D881.3(COM) L881.1
N$896: D882.3(COM) L882.1
N$897: D883.3(COM) L883.1
N$898: D884.3(COM) L884.1
N$899: D885.3(COM) L885.1
N$900: D886.3(COM) L886.1
N$901: D887.3(COM) L887.1
N$902: D888.3(COM) L888.1
N$903: D889.3(COM) L889.1
N$904: D890.3(COM) L890.1
N$905: D891.3(COM) L891.1
N$906: D892.3(COM) L892.1
N$907: D893.3(COM) L893.1
N$908: D894.3(COM) L894.1
N$909: D895.3(COM) L895.1
N$910: D896.3(COM) L896.1
N$927: D913.3(COM) L913.1
N$928: D914.3(COM) L914.1
N$929: D915.3(COM) L915.1
N$930: D916.3(COM) L916.1
N$931: D917.3(COM) L917.1
N$932: D918.3(COM) L918.1
N$933: D919.3(COM) L919.1
N$934: D920.3(COM) L920.1
N$935: D921.3(COM) L921.1
N$936: D922.3(COM) L922.1
N$937: D923.3(COM) L923.1
N$938: D924.3(COM) L924.1
N$939: D925.3(COM) L925.1
N$940: D926.3(COM) L926.1
N$941: D927.3(COM) L927.1
N$942: D928.3(COM) L928.1
N$959: D945.3(COM) L945.1
N$960: D946.3(COM) L946.1
N$961: D947.3(COM) L947.1
N$962: D948.3(COM) L948.1
N$963: D949.3(COM) L949.1
N$964: D950.3(COM) L950.1
N$965: D951.3(COM) L951.1
N$966: D952.3(COM) L952.1
N$967: D953.3(COM) L953.1
N$968: D954.3(COM) L954.1
N$969: D955.3(COM) L955.1
N$970: D956.3(COM) L956.1
N$971: D957.3(COM) L957.1
N$972: D958.3(COM) L958.1
N$973: D959.3(COM) L959.1
N$974: D960.3(COM) L960.1
N$991: D977.3(COM) L977.1
N$992: D978.3(COM) L978.1
N$993: D979.3(COM) L979.1
N$994: D980.3(COM) L980.1
N$995: D981.3(COM) L981.1
N$996: D982.3(COM) L982.1
N$997: D983.3(COM) L983.1
N$998: D984.3(COM) L984.1
N$999: D985.3(COM) L985.1
N$1000: D986.3(COM) L986.1
N$1001: D987.3(COM) L987.1
N$1002: D988.3(COM) L988.1
N$1003: D989.3(COM) L989.1
N$1004: D990.3(COM) L990.1
N$1005: D991.3(COM) L991.1
N$1006: D992.3(COM) L992.1
N$1023: D1009.3(COM) L1009.1
N$1024: D1010.3(COM) L1010.1
N$1025: D1011.3(COM) L1011.1
N$1026: D1012.3(COM) L1012.1
N$1027: D1013.3(COM) L1013.1
N$1028: D1014.3(COM) L1014.1
N$1029: D1015.3(COM) L1015.1
N$1030: D1016.3(COM) L1016.1
N$1031: D1017.3(COM) L1017.1
N$1032: D1018.3(COM) L1018.1
N$1033: D1019.3(COM) L1019.1
N$1034: D1020.3(COM) L1020.1
N$1035: D1021.3(COM) L1021.1
N$1036: D1022.3(COM) L1022.1
N$1037: D1023.3(COM) L1023.1
N$1038: D1024.3(COM) L1024.1
ROW17_SINK: D529.1(A1) D530.1(A1) D531.1(A1) D532.1(A1) D533.1(A1) D534.1(A1) D535.1(A1) D536.1(A1) D537.1(A1) D538.1(A1) D539.1(A1) D540.1(A1) D541.1(A1) D542.1(A1) D543.1(A1) D544.1(A1) ; also sheet 2,6
ROW17_SOURCE: D529.2(C2) D530.2(C2) D531.2(C2) D532.2(C2) D533.2(C2) D534.2(C2) D535.2(C2) D536.2(C2) D537.2(C2) D538.2(C2) D539.2(C2) D540.2(C2) D541.2(C2) D542.2(C2) D543.2(C2) D544.2(C2) ; also sheet 2,6
ROW18_SINK: D561.1(A1) D562.1(A1) D563.1(A1) D564.1(A1) D565.1(A1) D566.1(A1) D567.1(A1) D568.1(A1) D569.1(A1) D570.1(A1) D571.1(A1) D572.1(A1) D573.1(A1) D574.1(A1) D575.1(A1) D576.1(A1) ; also sheet 2,6
ROW18_SOURCE: D561.2(C2) D562.2(C2) D563.2(C2) D564.2(C2) D565.2(C2) D566.2(C2) D567.2(C2) D568.2(C2) D569.2(C2) D570.2(C2) D571.2(C2) D572.2(C2) D573.2(C2) D574.2(C2) D575.2(C2) D576.2(C2) ; also sheet 2,6
ROW19_SINK: D593.1(A1) D594.1(A1) D595.1(A1) D596.1(A1) D597.1(A1) D598.1(A1) D599.1(A1) D600.1(A1) D601.1(A1) D602.1(A1) D603.1(A1) D604.1(A1) D605.1(A1) D606.1(A1) D607.1(A1) D608.1(A1) ; also sheet 2,6
ROW19_SOURCE: D593.2(C2) D594.2(C2) D595.2(C2) D596.2(C2) D597.2(C2) D598.2(C2) D599.2(C2) D600.2(C2) D601.2(C2) D602.2(C2) D603.2(C2) D604.2(C2) D605.2(C2) D606.2(C2) D607.2(C2) D608.2(C2) ; also sheet 2,6
ROW20_SINK: D625.1(A1) D626.1(A1) D627.1(A1) D628.1(A1) D629.1(A1) D630.1(A1) D631.1(A1) D632.1(A1) D633.1(A1) D634.1(A1) D635.1(A1) D636.1(A1) D637.1(A1) D638.1(A1) D639.1(A1) D640.1(A1) ; also sheet 2,6
ROW20_SOURCE: D625.2(C2) D626.2(C2) D627.2(C2) D628.2(C2) D629.2(C2) D630.2(C2) D631.2(C2) D632.2(C2) D633.2(C2) D634.2(C2) D635.2(C2) D636.2(C2) D637.2(C2) D638.2(C2) D639.2(C2) D640.2(C2) ; also sheet 2,6
ROW21_SINK: D657.1(A1) D658.1(A1) D659.1(A1) D660.1(A1) D661.1(A1) D662.1(A1) D663.1(A1) D664.1(A1) D665.1(A1) D666.1(A1) D667.1(A1) D668.1(A1) D669.1(A1) D670.1(A1) D671.1(A1) D672.1(A1) ; also sheet 2,6
ROW21_SOURCE: D657.2(C2) D658.2(C2) D659.2(C2) D660.2(C2) D661.2(C2) D662.2(C2) D663.2(C2) D664.2(C2) D665.2(C2) D666.2(C2) D667.2(C2) D668.2(C2) D669.2(C2) D670.2(C2) D671.2(C2) D672.2(C2) ; also sheet 2,6
ROW22_SINK: D689.1(A1) D690.1(A1) D691.1(A1) D692.1(A1) D693.1(A1) D694.1(A1) D695.1(A1) D696.1(A1) D697.1(A1) D698.1(A1) D699.1(A1) D700.1(A1) D701.1(A1) D702.1(A1) D703.1(A1) D704.1(A1) ; also sheet 2,6
ROW22_SOURCE: D689.2(C2) D690.2(C2) D691.2(C2) D692.2(C2) D693.2(C2) D694.2(C2) D695.2(C2) D696.2(C2) D697.2(C2) D698.2(C2) D699.2(C2) D700.2(C2) D701.2(C2) D702.2(C2) D703.2(C2) D704.2(C2) ; also sheet 2,6
ROW23_SINK: D721.1(A1) D722.1(A1) D723.1(A1) D724.1(A1) D725.1(A1) D726.1(A1) D727.1(A1) D728.1(A1) D729.1(A1) D730.1(A1) D731.1(A1) D732.1(A1) D733.1(A1) D734.1(A1) D735.1(A1) D736.1(A1) ; also sheet 2,6
ROW23_SOURCE: D721.2(C2) D722.2(C2) D723.2(C2) D724.2(C2) D725.2(C2) D726.2(C2) D727.2(C2) D728.2(C2) D729.2(C2) D730.2(C2) D731.2(C2) D732.2(C2) D733.2(C2) D734.2(C2) D735.2(C2) D736.2(C2) ; also sheet 2,6
ROW24_SINK: D753.1(A1) D754.1(A1) D755.1(A1) D756.1(A1) D757.1(A1) D758.1(A1) D759.1(A1) D760.1(A1) D761.1(A1) D762.1(A1) D763.1(A1) D764.1(A1) D765.1(A1) D766.1(A1) D767.1(A1) D768.1(A1) ; also sheet 2,6
ROW24_SOURCE: D753.2(C2) D754.2(C2) D755.2(C2) D756.2(C2) D757.2(C2) D758.2(C2) D759.2(C2) D760.2(C2) D761.2(C2) D762.2(C2) D763.2(C2) D764.2(C2) D765.2(C2) D766.2(C2) D767.2(C2) D768.2(C2) ; also sheet 2,6
ROW25_SINK: D785.1(A1) D786.1(A1) D787.1(A1) D788.1(A1) D789.1(A1) D790.1(A1) D791.1(A1) D792.1(A1) D793.1(A1) D794.1(A1) D795.1(A1) D796.1(A1) D797.1(A1) D798.1(A1) D799.1(A1) D800.1(A1) ; also sheet 2,6
ROW25_SOURCE: D785.2(C2) D786.2(C2) D787.2(C2) D788.2(C2) D789.2(C2) D790.2(C2) D791.2(C2) D792.2(C2) D793.2(C2) D794.2(C2) D795.2(C2) D796.2(C2) D797.2(C2) D798.2(C2) D799.2(C2) D800.2(C2) ; also sheet 2,6
ROW26_SINK: D817.1(A1) D818.1(A1) D819.1(A1) D820.1(A1) D821.1(A1) D822.1(A1) D823.1(A1) D824.1(A1) D825.1(A1) D826.1(A1) D827.1(A1) D828.1(A1) D829.1(A1) D830.1(A1) D831.1(A1) D832.1(A1) ; also sheet 2,6
ROW26_SOURCE: D817.2(C2) D818.2(C2) D819.2(C2) D820.2(C2) D821.2(C2) D822.2(C2) D823.2(C2) D824.2(C2) D825.2(C2) D826.2(C2) D827.2(C2) D828.2(C2) D829.2(C2) D830.2(C2) D831.2(C2) D832.2(C2) ; also sheet 2,6
ROW27_SINK: D849.1(A1) D850.1(A1) D851.1(A1) D852.1(A1) D853.1(A1) D854.1(A1) D855.1(A1) D856.1(A1) D857.1(A1) D858.1(A1) D859.1(A1) D860.1(A1) D861.1(A1) D862.1(A1) D863.1(A1) D864.1(A1) ; also sheet 2,6
ROW27_SOURCE: D849.2(C2) D850.2(C2) D851.2(C2) D852.2(C2) D853.2(C2) D854.2(C2) D855.2(C2) D856.2(C2) D857.2(C2) D858.2(C2) D859.2(C2) D860.2(C2) D861.2(C2) D862.2(C2) D863.2(C2) D864.2(C2) ; also sheet 2,6
ROW28_SINK: D881.1(A1) D882.1(A1) D883.1(A1) D884.1(A1) D885.1(A1) D886.1(A1) D887.1(A1) D888.1(A1) D889.1(A1) D890.1(A1) D891.1(A1) D892.1(A1) D893.1(A1) D894.1(A1) D895.1(A1) D896.1(A1) ; also sheet 2,6
ROW28_SOURCE: D881.2(C2) D882.2(C2) D883.2(C2) D884.2(C2) D885.2(C2) D886.2(C2) D887.2(C2) D888.2(C2) D889.2(C2) D890.2(C2) D891.2(C2) D892.2(C2) D893.2(C2) D894.2(C2) D895.2(C2) D896.2(C2) ; also sheet 2,6
ROW29_SINK: D913.1(A1) D914.1(A1) D915.1(A1) D916.1(A1) D917.1(A1) D918.1(A1) D919.1(A1) D920.1(A1) D921.1(A1) D922.1(A1) D923.1(A1) D924.1(A1) D925.1(A1) D926.1(A1) D927.1(A1) D928.1(A1) ; also sheet 2,6
ROW29_SOURCE: D913.2(C2) D914.2(C2) D915.2(C2) D916.2(C2) D917.2(C2) D918.2(C2) D919.2(C2) D920.2(C2) D921.2(C2) D922.2(C2) D923.2(C2) D924.2(C2) D925.2(C2) D926.2(C2) D927.2(C2) D928.2(C2) ; also sheet 2,6
ROW30_SINK: D945.1(A1) D946.1(A1) D947.1(A1) D948.1(A1) D949.1(A1) D950.1(A1) D951.1(A1) D952.1(A1) D953.1(A1) D954.1(A1) D955.1(A1) D956.1(A1) D957.1(A1) D958.1(A1) D959.1(A1) D960.1(A1) ; also sheet 2,6
ROW30_SOURCE: D945.2(C2) D946.2(C2) D947.2(C2) D948.2(C2) D949.2(C2) D950.2(C2) D951.2(C2) D952.2(C2) D953.2(C2) D954.2(C2) D955.2(C2) D956.2(C2) D957.2(C2) D958.2(C2) D959.2(C2) D960.2(C2) ; also sheet 2,6
ROW31_SINK: D977.1(A1) D978.1(A1) D979.1(A1) D980.1(A1) D981.1(A1) D982.1(A1) D983.1(A1) D984.1(A1) D985.1(A1) D986.1(A1) D987.1(A1) D988.1(A1) D989.1(A1) D990.1(A1) D991.1(A1) D992.1(A1) ; also sheet 2,6
ROW31_SOURCE: D977.2(C2) D978.2(C2) D979.2(C2) D980.2(C2) D981.2(C2) D982.2(C2) D983.2(C2) D984.2(C2) D985.2(C2) D986.2(C2) D987.2(C2) D988.2(C2) D989.2(C2) D990.2(C2) D991.2(C2) D992.2(C2) ; also sheet 2,6
ROW32_SINK: D1009.1(A1) D1010.1(A1) D1011.1(A1) D1012.1(A1) D1013.1(A1) D1014.1(A1) D1015.1(A1) D1016.1(A1) D1017.1(A1) D1018.1(A1) D1019.1(A1) D1020.1(A1) D1021.1(A1) D1022.1(A1) D1023.1(A1) D1024.1(A1) ; also sheet 2,6
ROW32_SOURCE: D1009.2(C2) D1010.2(C2) D1011.2(C2) D1012.2(C2) D1013.2(C2) D1014.2(C2) D1015.2(C2) D1016.2(C2) D1017.2(C2) D1018.2(C2) D1019.2(C2) D1020.2(C2) D1021.2(C2) D1022.2(C2) D1023.2(C2) D1024.2(C2) ; also sheet 2,6

## Library data of the parts
CONN1 CONN2 = con-lumberg:MICS-SMD14: CONNECTOR; OC_FARNELL: unknown; OC_NEWARK: unknown
D1-D1024 = SparkFun-DiscreteSemi:BAV99: Series-pair diode array Two small signal silicon diodes connected anode to cathode. Connections to all three nodes available. Link to datasheet <https://www.fairchildsemi.com/datasheets/BA/BAV99.pdf> SparkFun Products: SparkFun AutoDriver <https://www.sparkfun.com/products/13752>; PROD_ID: DIO-10647
IC1 = 74xx-eu:74*75: 4-bit bistable LATCH
IC2 IC4 = 40xx:4024: 7-stage binary/ripple COUNTER
IC3 = 74xx-eu:74*139: Dual 2-line to 4-line DECODER/DEMULTIPLEXER; SPICEPREFIX: X
IC5 IC8 IC11 IC14 IC17 IC20 IC23 IC26 = 45xx:4514: 4-bit latch 4-16 line DECODER
IC6 IC9 IC13 IC16 IC19 IC22 IC25 IC28 = Toshiba TBD6x783A:TBD62083A: 8channel sink type DMOS transistor array TB62083A series and TB62084A series are DMOS transistor array with 8 circuits. It has a clamp diode for switching inductive loads built-in in each output. Please be careful about thermal conditions during use. Features 8 circuits built-in High voltage: VOUT = 50 V (MAX) High current: IOUT = 500 mA/ch (MAX) Input voltage (output on): TBD62083A series 2.5 V (MIN) TBD62084A series 7.0 V (MIN) Input voltage (output off): TBD62083A series 0.6 V (MAX) TBD62084A series 1.0 V (MAX) Package: PG type P-DIP18-300-2.54-001 FG type SOP18-P-375-1.27 FNG type SSOP18-P-225-0.65 FWG type P-SOP18-0812-1.27-001
IC7 IC10 IC12 IC15 IC18 IC21 IC24 IC27 = Toshiba TBD6x783A:TBD62783A: 8channel source type DMOS transistor array TBD62783A series are DMOS transistor array with 8 circuits. It has a clamp diode for switching inductive loads built-in in each output. Please be careful about thermal conditions during use. Features 8 circuits built-in High voltage: VOUT = 50 V (MAX) High current: IOUT = -500 mA/ch (MAX) Input voltage (output on): 2.0 V (MIN) Input voltage (output off): 0.6 V (MAX) TBD62084A series 1.0 V (MAX) Package: PG type P-DIP18-300-2.54-001 FG type SOP18-P-375-1.27 FNG type SSOP18-P-225-0.65 FWG type P-SOP18-0812-1.27-001
L1-L1024 = inductor-neosid:SD8: INDUCTOR nominal inductance; OC_FARNELL: unknown; OC_NEWARK: unknown